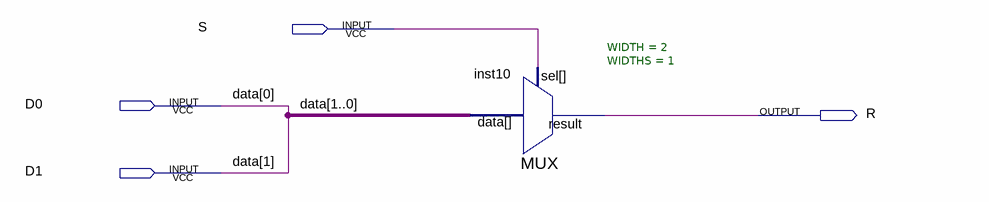
[diagram p0: schematic sheet]
// Quartus schematic mux1to2.bdf as structural Verilog: 1 symbols, 4 pins
module mux1to2 (
  input  S,
  input  D0,
  input  D1,
  output R
);

  MUX #(.WIDTH(2), .WIDTHS(1)) inst10 (.data({D1, D0}), .sel(S), .result(R));

  // Other names for the same wires on the sheet: data[1:0] = {D1, D0}
endmodule
